# EasyEDA Pro project ProProject_Access Control Core_2024-06-07.epro, schematic V2.0.1 LCD Backpack Schematic
Create Date: 2024-05-06; Page Name: P1; Project Name: Access Control V2; Schematic Name: V2.0.1 LCD Backpack Schematic; Update Date: 2024-05-06; Company: EasyEDA.com; Drawn: EasyEDA; Page Size: A4; Part Number: JLCPCB-002; Reviewed: EasyEDA; Version: V0.1
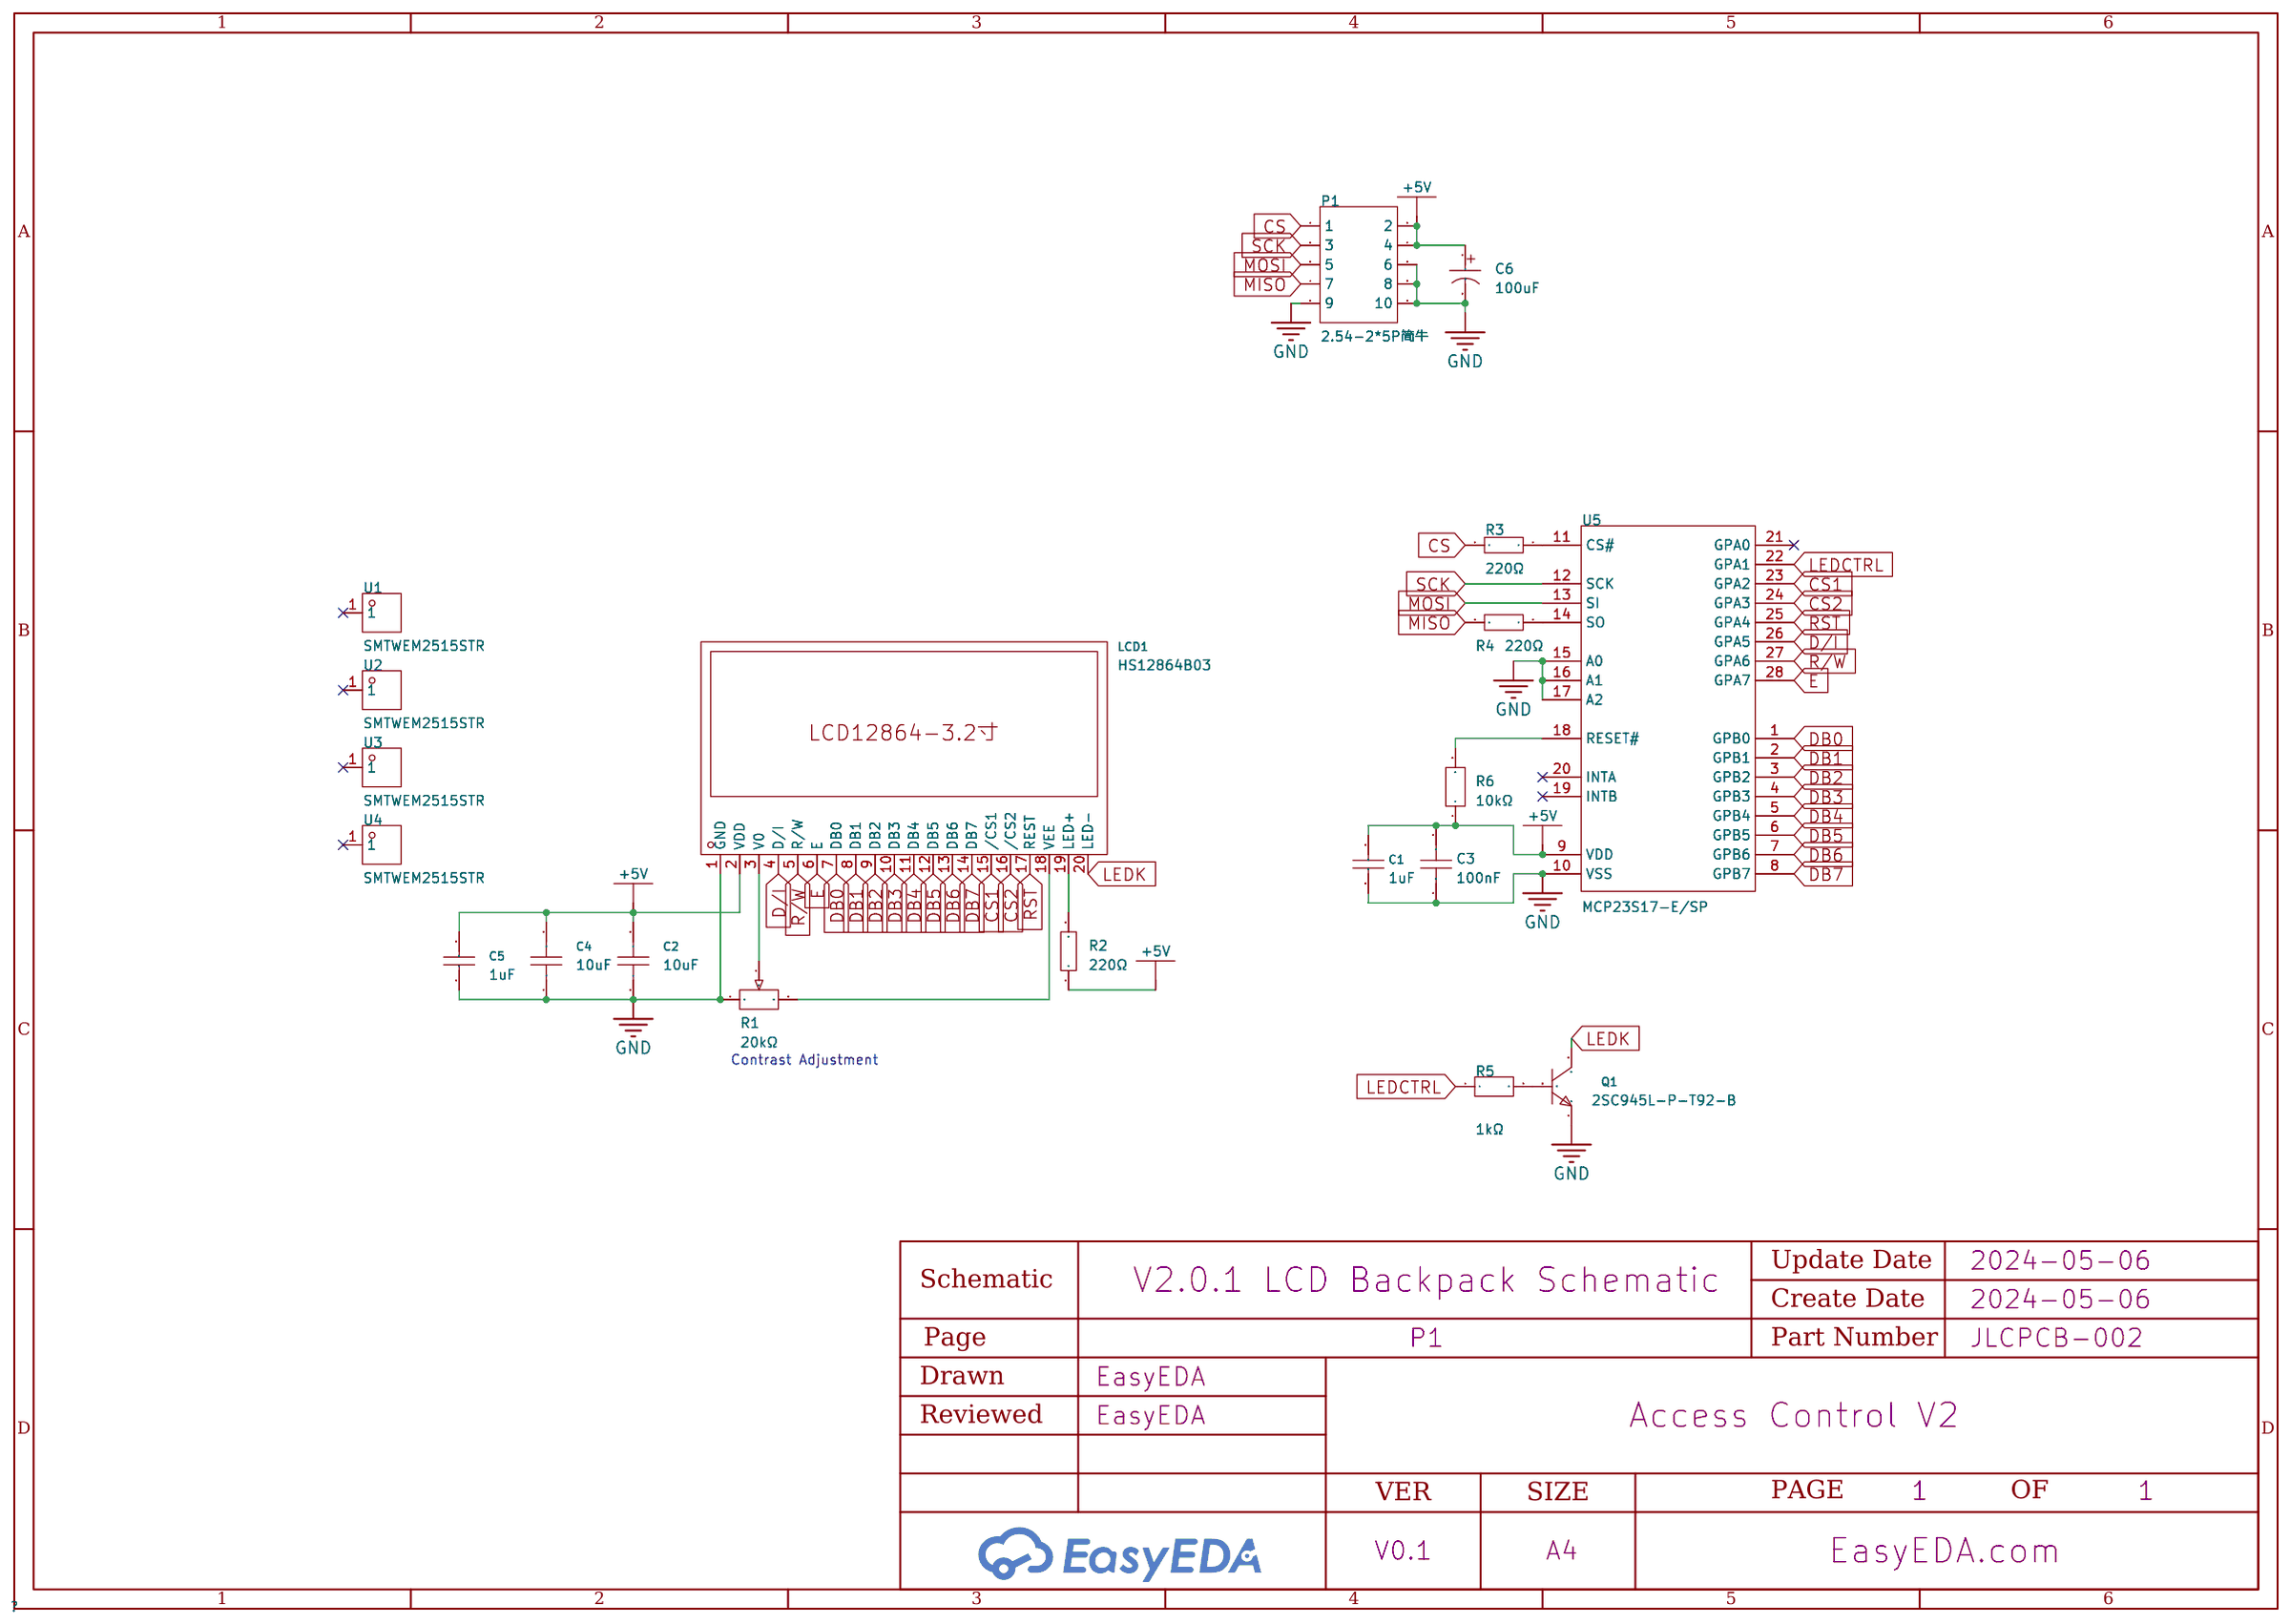
[diagram p3: schematic sheet]

## Parts
C1  1uF  [CAP-TH_L8.5-W5.0-P5.00-D1.2]
C2  10uF  [CAP-TH_L5.5-W3.8-P3.50-D0.6]
C3  100nF  [CAP-TH_L4.2-W3.5-P2.54-D0.5]
C4  10uF  [CAP-TH_L5.5-W3.8-P3.50-D0.6]
C5  1uF  [CAP-TH_L8.5-W5.0-P5.00-D1.2]
C6  100uF  [CAP-TH_BD5.0-P2.00-D0.8-FD]
LCD1  HS12864B03  [LCD-TH_L93.0-W65.0_HS12864B03]
P1  2.54-2*5P简牛  [IDC-TH_10P-P2.54_C5665]
Q1  2SC945L-P-T92-B  [TO-92-3_L4.8-W3.7-P2.54-L]
R1  20kΩ  [RES-ADJ-TH_3P-L7.1-W6.9-P2.50-L_3362P]
R2  220Ω  [RES-TH_BD2.2-L6.5-P10.50-D0.6]
R3  220Ω  [RES-TH_BD2.2-L6.5-P10.50-D0.6]
R4  220Ω  [RES-TH_BD2.2-L6.5-P10.50-D0.6]
R5  1kΩ  [RES-TH_BD2.7-L6.2-P10.20-D0.4]
R6  10kΩ  [RES-TH_BD2.7-L6.2-P10.20-D0.4]
U1  SMTWEM2515STR  [SMD_BD5.0-D3.5]
U2  SMTWEM2515STR  [SMD_BD5.0-D3.5]
U3  SMTWEM2515STR  [SMD_BD5.0-D3.5]
U4  SMTWEM2515STR  [SMD_BD5.0-D3.5]
U5  MCP23S17-E/SP  [DIP-28_L34.6-W7.3-P2.54-LS10.2-BL]

## Library data of the parts
C1 C5 = CT4-0805B105K500F3: Capacitance:1uF Tolerance:±10% Tolerance:±10% Voltage Rated: Temperature Coefficient:; LCSC Part Name: 1uF ±10% 50V; Supplier Part: C94708; Manufacturer: FH(风华); Supplier Footprint: 插件,P=5.08mm; JLCPCB Part Class: Extended Part; Datasheet: https://atta.szlcsc.com/upload/public/pdf/source/20190402/C385200_059806A6312B28FF1421A2413EB641E1.pdf; Supplier: LCSC; Tolerance: ±10%
C2 C4 = CD1E106MC9BER2F100: Capacitance:10uF Tolerance:±20% Tolerance:±20% Voltage Rated: Temperature Coefficient:; LCSC Part Name: 10uF ±20% 25V; Supplier Part: C2761733; Manufacturer: Dersonic(德尔创); Supplier Footprint: 插件,P=5.08mm; JLCPCB Part Class: Extended Part; Datasheet: https://atta.szlcsc.com/upload/public/pdf/source/20210512/C2761733_48A4F8FFA54EF14BEC181E01EC41507A.pdf; Supplier: LCSC; Tolerance: ±20%
C3 = 178MU0006: Capacitance: Tolerance:±10% Tolerance:±10% Voltage Rated: Temperature Coefficient:; LCSC Part Name: 100nF ±10% 50V; Supplier Part: C5632430; Manufacturer: KNSCHA(科尼盛); Supplier Footprint: 插件,P=2.54mm; JLCPCB Part Class: Extended Part; Datasheet: https://atta.szlcsc.com/upload/public/pdf/source/20230506/6B3136079A6D587E863927628E877AC6.pdf; Supplier: LCSC; Tolerance: ±10%
C6 = KS107M016D07RR0VH2FP0: Capacitance:100uF Tolerance:±20% Tolerance:±20% Rated Voltage: Ripple Current:- Equivalent Series Resistance(ESR):- Lead Spacing: φD: L: Lifetime @ Temp:1000hrs@105℃ Operating Temperature:-40℃~+105℃ Operating Temperature:-40℃~+105℃; LCSC Part Name: 100uF ±20% 16V; Supplier Part: C43803; Manufacturer: CX(承兴); Supplier Footprint: 插件,D5xL7mm; JLCPCB Part Class: Extended Part; Datasheet: https://atta.szlcsc.com/upload/public/pdf/source/20230817/0DB19D47181DB7F2222DAA6444591EF5.pdf; Supplier: LCSC; Tolerance: ±20%; Lifetime @ Temp: 1000hrs@105℃; Operating Temperature: -40℃~+105℃
LCD1 = HS12864B03: Main Control Chip:KS0107 Size:3.2; LCSC Part Name: 3.2寸 图形点阵LCD液晶屏LCM显示屏; Supplier Part: C2939935; Manufacturer: HS(汉昇); Datasheet: https://atta.szlcsc.com/upload/public/pdf/source/20220105/98EDE51BFFCFFFC80811C153C05B515C.pdf; Supplier: LCSC; Main Control Chip: KS0107; Size: 3.2
P1 = 2.54-2*5P简牛: Connector Type:简牛座 Pitch:2.54mm Structure:2x5P Holder Type:Straight Row Spacing:2.54mm Number of Rows:2 Pin Number in each Row:5 Contact Material:- Contact Plating:-; LCSC Part Name: 2.54mm 2x5P 排数:2 每排P数:5; Supplier Part: C5665; Manufacturer: BOOMELE(博穆精密); Supplier Footprint: 插件,P=2.54mm; JLCPCB Part Class: Extended Part; Datasheet: https://atta.szlcsc.com/upload/public/pdf/source/20140331/1457707037896.pdf; Supplier: LCSC; Connector Type: 简牛座; Pitch: 2.54mm; Structure: 2x5P; Holder Type: Straight; Row Spacing: 2.54mm; Number of Rows: 2; Pin Number in each Row: 5
Q1 = 2SC945L-P-T92-B: Transistor Type: Collector Current (Ic): Collector-Emitter Breakdown Voltage (Vceo): Power Dissipation (Pd): DC Current Gain (hFE@Ic,Vce):200@1mA,6V DC Current Gain (hFE@Ic,Vce):200@1mA,6V Transition Frequency (fT):190MHz Collector Cut-Off Current (Icbo):; LCSC Part Name: NPN 电流:150mA 耐压:50V hfe=200~400; Supplier Part: C73312; Manufacturer: UTC(友顺); Supplier Footprint: TO-92-2.54mm; JLCPCB Part Class: Extended Part; Datasheet: https://atta.szlcsc.com/upload/public/pdf/source/20160514/1463194849728.pdf; Supplier: LCSC; DC Current Gain (hFE@Ic,Vce): 200@1mA,6V; Transition Frequency (fT): 190MHz; Collector Cut-Off Current (Icbo): 100nA; Collector-Emitter Saturation Voltage (VCE(sat)@Ic,Ib): 100mV@100mA,10mA
R1 = 3362P-1-203_C118933: Resistance: Tolerance:±10% Tolerance:±10%; LCSC Part Name: 20kΩ ±10%; Supplier Part: C118933; Manufacturer: BOCHEN(博晨); Manufacturer Part: 3362P-1-203; Supplier Footprint: 插件; JLCPCB Part Class: Extended Part; Datasheet: https://atta.szlcsc.com/upload/public/pdf/source/20171114/C118933_15106326602881117422.pdf; Supplier: LCSC; Tolerance: ±10%
R2-R4 = MF1/4W-220Ω±1% T: Type:Metal Film Resistors Resistance: Tolerance:±1% Tolerance:±1% Overload Voltage (Max):250V Power(Watts):250mW Temperature Coefficient:±100ppm/℃ Temperature Coefficient:±100ppm/℃ Operating Temperature Range:-55℃~+155℃ Operating Temperature Range:-55℃~+1; LCSC Part Name: 220Ω ±1% 250mW 金属膜电阻; Supplier Part: C127220; Manufacturer: CCO(千志电子); Supplier Footprint: 插件,D2.3xL6.5mm; JLCPCB Part Class: Extended Part; Datasheet: https://atta.szlcsc.com/upload/public/pdf/source/20190910/C427326_62A6D058BC0FF74963A2F22379CA06CE.pdf; Supplier: LCSC; Type: Metal Film Resistors; Tolerance: ±1%; Overload Voltage (Max): 250V; Power(Watts): 250mW; Temperature Coefficient: ±100ppm/℃; Operating Temperature Range: -55℃~+155℃
R5 = MF1/4W-1K±1%-ST52: Type:Metal Film Resistors Resistance: Tolerance:±1% Tolerance:±1% Overload Voltage (Max):250V Power(Watts):250mW Temperature Coefficient:±100ppm/℃ Temperature Coefficient:±100ppm/℃ Operating Temperature Range:-55℃~+155℃ Operating Temperature Range:-55℃~+1; LCSC Part Name: 金属膜电阻 1kΩ ±1% 250mW; Supplier Part: C2903245; Manufacturer: VO(翔胜); Supplier Footprint: 插件,2.7x6.2mm; JLCPCB Part Class: Extended Part; Datasheet: https://atta.szlcsc.com/upload/public/pdf/source/20200609/C601728_5AA4C0C8E12E11069DA2C3356F29D1F2.pdf; Supplier: LCSC; Type: Metal Film Resistors; Tolerance: ±1%; Overload Voltage (Max): 250V; Power(Watts): 250mW; Temperature Coefficient: ±100ppm/℃; Operating Temperature Range: -55℃~+155℃
R6 = MF1/4W-10K±1%-ST26: Type:Metal Film Resistors Resistance: Tolerance:±1% Tolerance:±1% Overload Voltage (Max):250V Power(Watts):250mW Temperature Coefficient:±100ppm/℃ Temperature Coefficient:±100ppm/℃ Operating Temperature Range:-55℃~+155℃ Operating Temperature Range:-55℃~+1; LCSC Part Name: 金属膜电阻 10kΩ ±1% 250mW; Supplier Part: C2903267; Manufacturer: VO(翔胜); Supplier Footprint: 插件,2.7x6.2mm; JLCPCB Part Class: Extended Part; Datasheet: https://atta.szlcsc.com/upload/public/pdf/source/20200609/C601728_5AA4C0C8E12E11069DA2C3356F29D1F2.pdf; Supplier: LCSC; Type: Metal Film Resistors; Tolerance: ±1%; Overload Voltage (Max): 250V; Power(Watts): 250mW; Temperature Coefficient: ±100ppm/℃; Operating Temperature Range: -55℃~+155℃
U1-U4 = SMTWEM2515STR: LCSC Part Name: M2.5 贴片螺母 L=1.5mm; Supplier Part: C5301785; Manufacturer: YIYUAN(怡远); Supplier Footprint: M2.5; Datasheet: https://atta.szlcsc.com/upload/public/pdf/source/20221206/40612B47A9AD06C6C88211E02916916D.pdf; Supplier: LCSC
U5 = MCP23S17-E/SP: Interface: Number of I/O:16 Interrupt Output:有中断输出 Output Type: Supply Voltage:1.8V~5.5V Supply Voltage:1.8V~5.5V Output Source current:25mA Output Sink Current:25mA Clock Frequency:10MHz Operating Temperature:-40℃~+125℃ Operating Temperature:-40℃~+125℃; Supplier Part: C148096; Manufacturer: MICROCHIP(美国微芯); Supplier Footprint: DIP-28; JLCPCB Part Class: Extended Part; Datasheet: https://atta.szlcsc.com/upload/public/pdf/source/20171120/C148096_15111748815831131858.pdf; Supplier: LCSC; Number of I/O: 16; Interrupt Output: 有中断输出; Supply Voltage: 1.8V~5.5V; Output Source current: 25mA; Output Sink Current: 25mA; Clock Frequency: 10MHz; Operating Temperature: -40℃~+125℃

## Nets
+5V: C1.2 C2.2 C3.2 C4.2 C5.2 C6.1 LCD1.2(VDD) P1.2 P1.4 R2.1 R6.1 U5.9(VDD)
GND: C1.1 C2.1 C3.1 C4.1 C5.1 C6.2 LCD1.1(GND) P1.6 P1.8 P1.9 P1.10 Q1.1(E) R1.1 U5.10(VSS) U5.15(A0) U5.16(A1) U5.17(A2)
CS: P1.1 R3.2
CS1: LCD1.15(/CS1) U5.23(GPA2)
CS2: LCD1.16(/CS2) U5.24(GPA3)
D/I: LCD1.4(D/I) U5.26(GPA5)
DB0: LCD1.7(DB0) U5.1(GPB0)
DB1: LCD1.8(DB1) U5.2(GPB1)
DB2: LCD1.9(DB2) U5.3(GPB2)
DB3: LCD1.10(DB3) U5.4(GPB3)
DB4: LCD1.11(DB4) U5.5(GPB4)
DB5: LCD1.12(DB5) U5.6(GPB5)
DB6: LCD1.13(DB6) U5.7(GPB6)
DB7: LCD1.14(DB7) U5.8(GPB7)
E: LCD1.6(E) U5.28(GPA7)
LEDCTRL: R5.1 U5.22(GPA1)
LEDK: LCD1.20(LED-) Q1.2(C)
MISO: P1.7 R4.2
MOSI: P1.5 U5.13(SI)
R/W: LCD1.5(R/W) U5.27(GPA6)
RST: LCD1.17(REST) U5.25(GPA4)
SCK: P1.3 U5.12(SCK)
$1N391: LCD1.3(V0) R1.2
$1N397: LCD1.18(VEE) R1.3
$1N591: LCD1.19(LED+) R2.2
$1N1010: R6.2 U5.18(RESET#)
$1N1103: R3.1 U5.11(CS#)
$1N1151: R4.1 U5.14(SO)
$1N2353: Q1.3(B) R5.2

Not connected (* = marked no-connect by the designer): U1 1*; U2 1*; U3 1*; U4 1*; U5 19(INTB)* 20(INTA)* 21(GPA0)*

## Notes on the sheet
- Contrast Adjustment
